# EAGLE design theremin_gross (EAGLE 5.10)
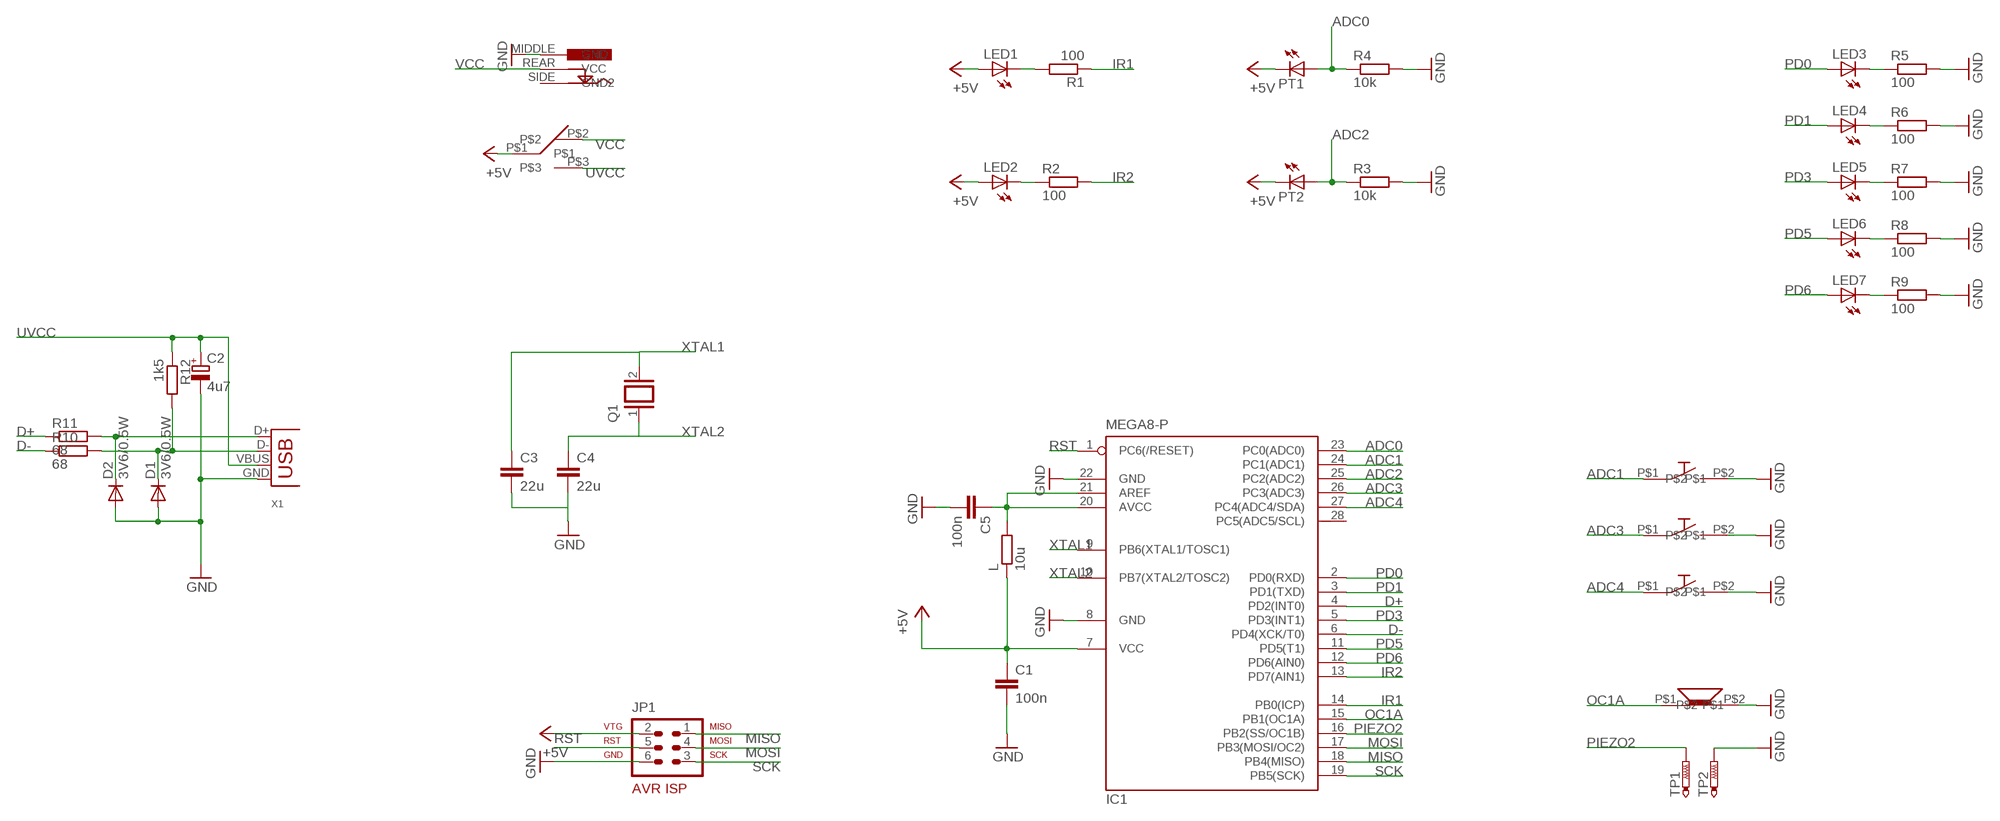
[diagram p0: schematic, sheet 1]

## Parts
C1  100n  C-EU025-025X050  [C025-025X050]
C2  4u7  CPOL-EUE1.8-4  [E1,8-4]
C3  22u  C-EU025-025X050  [C025-025X050]
C4  22u  C-EU025-025X050  [C025-025X050]
C5  100n  C-EU025-025X050  [C025-025X050]
D1  3V6/0.5W  DIODE-D-5  [D-5]
D2  3V6/0.5W  DIODE-D-5  [D-5]
IC1  MEGA8-P  [DIL28-3]
JP1  AVR-ISP-6  [AVR-ISP-6]
L  10u  R-EU_0207/10  [0207/10]
LED1  LED3MM  [LED3MM]
LED2  LED3MM  [LED3MM]
LED3  LED5MM  [LED5MM]
LED4  LED5MM  [LED5MM]
LED5  LED5MM  [LED5MM]
LED6  LED5MM  [LED5MM]
LED7  LED5MM  [LED5MM]
PT1  LED3MM  [LED3MM]
PT2  LED3MM  [LED3MM]
Q1  XTAL/S  [QS]
R1  100  R-EU_0207/10  [0207/10]
R2  100  R-EU_0207/10  [0207/10]
R3  10k  R-EU_0207/10  [0207/10]
R4  10k  R-EU_0207/10  [0207/10]
R5  100  R-EU_0207/10  [0207/10]
R6  100  R-EU_0207/10  [0207/10]
R7  100  R-EU_0207/10  [0207/10]
R8  100  R-EU_0207/10  [0207/10]
R9  100  R-EU_0207/10  [0207/10]
R10  68  R-EU_0207/10  [0207/10]
R11  68  R-EU_0207/10  [0207/10]
R12  1k5  R-EU_0207/10  [0207/10]
TP1  PTR1PAD1-20  [P1-20]
TP2  PTR1PAD1-20  [P1-20]
U$1  TASTER1032  [TASTER1032]
U$2  JACK-2.1MM  [JACK-2.1MM]
U$3  SCHALTER-KIP1PUM  [CSD-KIP1PUM]
U$4  PIEZO-A3  [PIEZO-A3]
U$6  TASTER1032  [TASTER1032]
U$7  TASTER1032  [TASTER1032]
X1  USB-MB-H  [USB-MB-H]

## Nets
+5V: C1.1 IC1.7(VCC) JP1.2 L.1 LED1.A LED2.A PT1.K(C) PT2.K(C) U$3.P$1
ADC0: IC1.23(PC0(ADC0)) PT1.A R4.1
ADC1: IC1.24(PC1(ADC1)) U$1.P$1
ADC2: IC1.25(PC2(ADC2)) PT2.A R3.1
ADC3: IC1.26(PC3(ADC3)) U$6.P$1
ADC4: IC1.27(PC4(ADC4/SDA)) U$7.P$1
D+: IC1.4(PD2(INT0)) R11.1
D-: IC1.6(PD4(XCK/T0)) R10.1
GND: C1.2 C2.- C3.2 C4.2 C5.2 D1.A D2.A IC1.8(GND) IC1.22(GND) JP1.6 R3.2 R4.2 R5.2 R6.2 R7.2 R8.2 R9.2 TP2.TP U$1.P$2 U$2.MIDDLE(GND) U$4.P$2 U$6.P$2 U$7.P$2 X1.GND
IR1: IC1.14(PB0(ICP)) R1.1
IR2: IC1.13(PD7(AIN1)) R2.2
MISO: IC1.18(PB4(MISO)) JP1.1
MOSI: IC1.17(PB3(MOSI/OC2)) JP1.4
N$1: LED2.K(C) R2.1
N$2: LED1.K(C) R1.2
N$3: LED3.K(C) R5.1
N$4: D1.C R10.2 R12.2 X1.D-
N$5: LED4.K(C) R6.1
N$6: D2.C R11.2 X1.D+
N$7: LED5.K(C) R7.1
N$8: C5.1 IC1.20(AVCC) IC1.21(AREF) L.2
N$9: LED6.K(C) R8.1
N$11: LED7.K(C) R9.1
OC1A: IC1.15(PB1(OC1A)) U$4.P$1
PD0: IC1.2(PD0(RXD)) LED3.A
PD1: IC1.3(PD1(TXD)) LED4.A
PD3: IC1.5(PD3(INT1)) LED5.A
PD5: IC1.11(PD5(T1)) LED6.A
PD6: IC1.12(PD6(AIN0)) LED7.A
PIEZO2: IC1.16(PB2(SS/OC1B)) TP1.TP
RST: IC1.1(PC6(/RESET)) JP1.5
SCK: IC1.19(PB5(SCK)) JP1.3
UVCC: C2.+ R12.1 U$3.P$3 X1.VBUS
VCC: U$2.REAR(VCC) U$3.P$2
XTAL1: C3.1 IC1.9(PB6(XTAL1/TOSC1)) Q1.2
XTAL2: C4.1 IC1.10(PB7(XTAL2/TOSC2)) Q1.1
Unconnected: IC1.28(PC5(ADC5/SCL)) U$2.SIDE(GND2)

## Library data of the parts
C1 C3-C5 = resistor:C-EU: CAPACITOR, European symbol
C2 = rcl:CPOL-EU: POLARIZED CAPACITOR, European symbol
D1 D2 = diode:DIODE-: DIODE
IC1 = atmel:MEGA8-P: MICROCONTROLLER 8 Kbytes FLASH, 1 kbytes SRAM, 512 bytes EEPROM, USART, 4-channel 10 bit ADC, 2-channel 8 bit ADC Pin compatible with Atmega48, ATMega88, ATMega168 Source: avr.lbr
JP1 = avr-6:AVR-ISP-6: AVR ISP-6 Serial Programming Header
L = rcl:R-EU_: RESISTOR, European symbol
LED1-LED7 PT1 PT2 = led:LED: LED OSRAM: - CHIPLED LG R971, LG N971, LY N971, LG Q971, LY Q971, LO R971, LY R971 LH N974, LH R974 LS Q976, LO Q976, LY Q976 LO Q996 - Hyper CHIPLED LW Q18S LB Q993, LB Q99A, LB R99A - SideLED LS A670, LO A670, LY A670, LG A670, LP A670 LB A673, LV A673, LT A673, LW A673 LH A674 LY A675 LS A676, LA A676, LO A676, LY A676, LW A676 LS A679, LY A679, LG A679 - Hyper Micro SIDELED® LS Y876, LA Y876, LO Y876, LY Y876 LT Y87S - SmartLED LW L88C, LW L88S LB L89C, LB L89S, LG L890 LS L89K, LO L89K, LY L89K LS L896, LA L896, LO L896, LY L896 - TOPLED LS T670, LO T670, LY T670, LG T670, LP T670 LSG T670, LSP T670, LSY T670, LOP T670, LYG T670 LG T671, LOG T671, LSG T671 LB T673, LV T673, LT T673, LW T673 LH T674 LS T676, LA T676, LO T676, LY T676, LB T676, LH T676, LSB T676, LW T676 LB T67C, LV T67C, LT T67C, LS T67K, LO T67K, LY T67K, LW E67C LS E67B, LA E67B, LO E67B, LY E67B, LB E67C, LV E67C, LT E67C LW T67C LS T679, LY T679, LG T679 LS T770, LO T770, LY T770, LG T770, LP T770 LB T773, LV T773, LT T773, LW T773 LH T774 LS E675, LA E675, LY E675, LS T675 LS T776, LA T776, LO T776, LY T776, LB T776 LHGB T686 LT T68C, LB T68C - Hyper Mini TOPLED® LB M676 - Mini TOPLED Santana® LG M470 LS M47K, LO M47K, LY M47K Source: http://www.osram.convergy.de LUXEON: - LUMILED® LXK2-PW12-R00, LXK2-PW12-S00, LXK2-PW14-U00, LXK2-PW14-V00 LXK2-PM12-R00, LXK2-PM12-S00, LXK2-PM14-U00 LXK2-PE12-Q00, LXK2-PE12-R00, LXK2-PE12-S00, LXK2-PE14-T00, LXK2-PE14-U00 LXK2-PB12-K00, LXK2-PB12-L00, LXK2-PB12-M00, LXK2-PB14-N00, LXK2-PB14-P00, LXK2-PB14-Q00 LXK2-PR12-L00, LXK2-PR12-M00, LXK2-PR14-Q00, LXK2-PR14-R00 LXK2-PD12-Q00, LXK2-PD12-R00, LXK2-PD12-S00 LXK2-PH12-R00, LXK2-PH12-S00 LXK2-PL12-P00, LXK2-PL12-Q00, LXK2-PL12-R00 Source: www.luxeon.com KINGBRIGHT: KA-3528ASYC Source: www.kingbright.com
Q1 = special:XTAL/S: CRYSTAL
R1-R12 = resistor:R-EU_: RESISTOR, European symbol
TP1 TP2 = testpad:PTR1: TEST PIN
U$1 U$6 U$7 = theremin:TASTER1032
U$2 = theremin:JACK-2.1MM
U$3 = theremin:SCHALTER-KIP1PUM
U$4 = theremin:PIEZO-A3: pui audio Transducer (Piezo) AT-5210-TT-R
X1 = con-usb-3:USB: USB Connectors

## Board
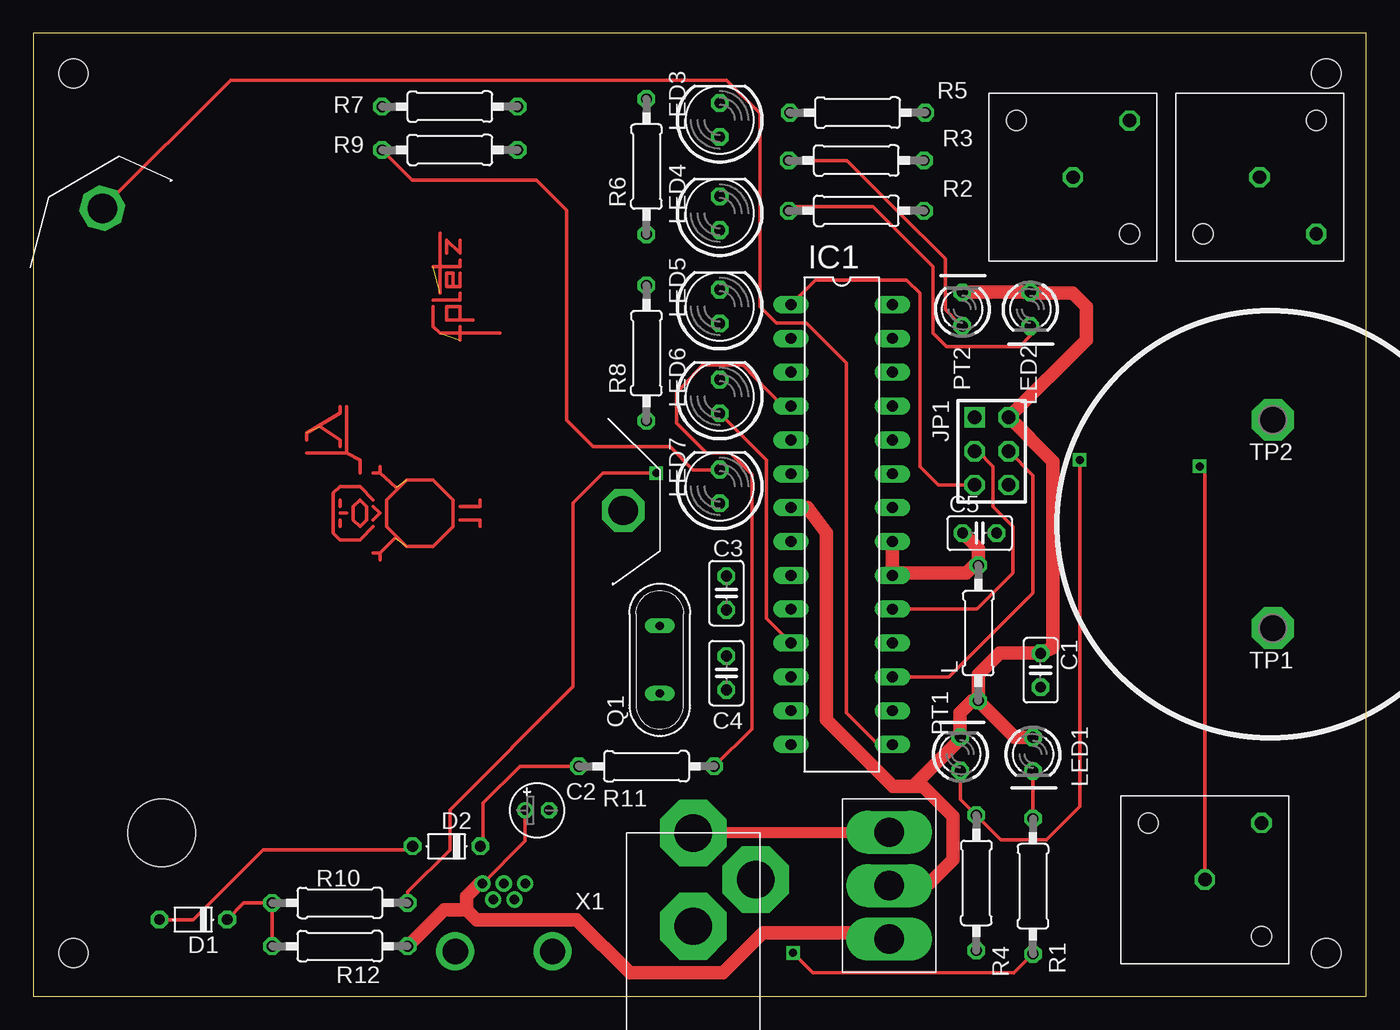
[diagram p1: board, top side]
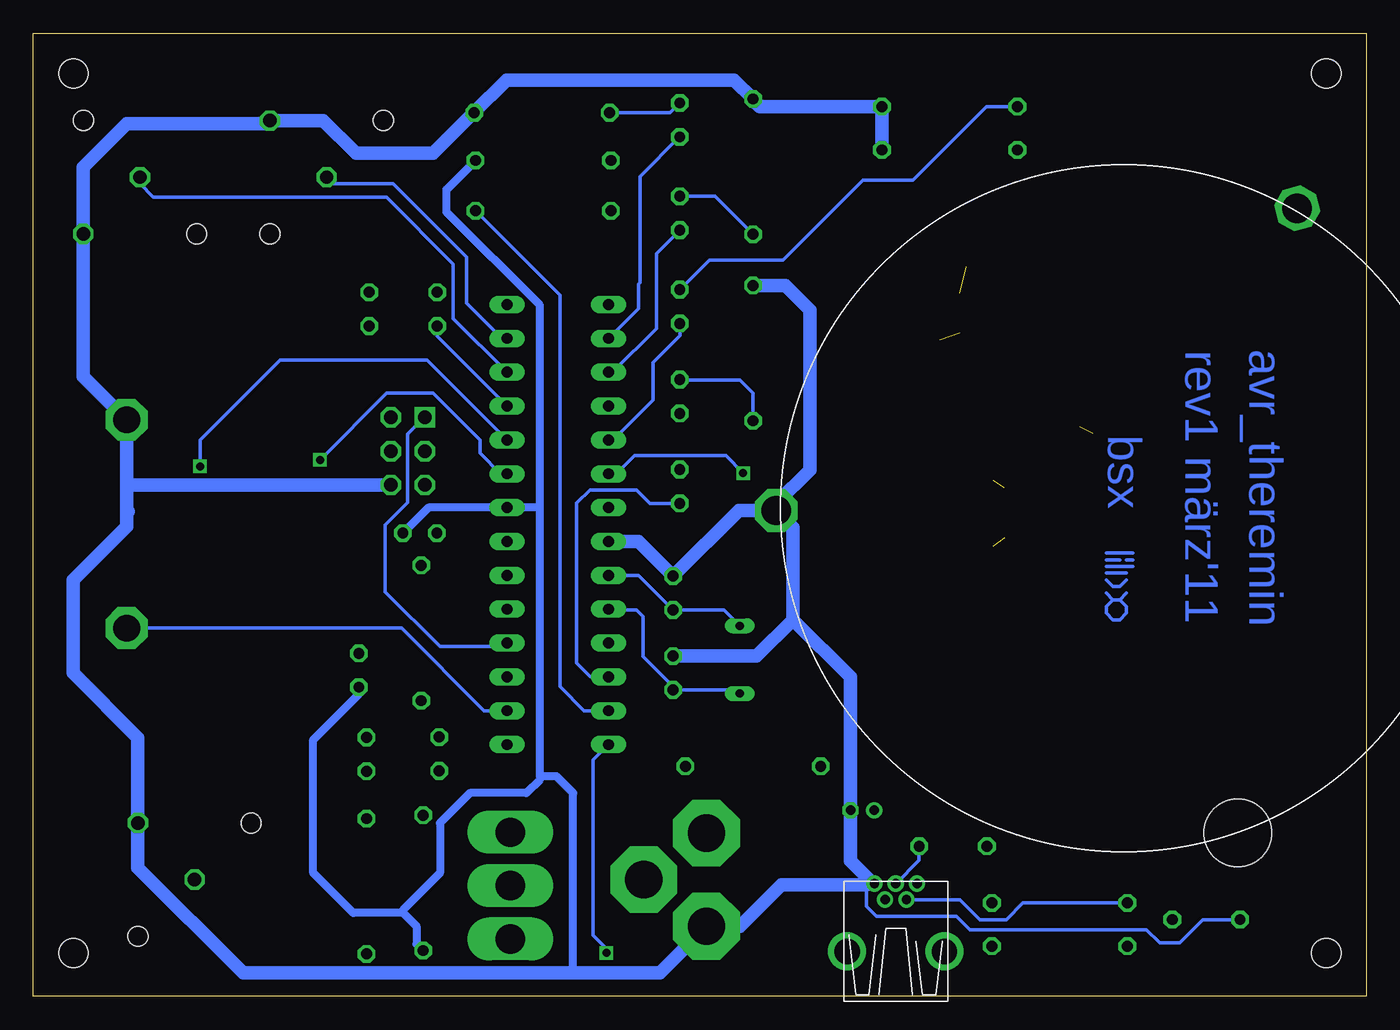
[diagram p2: board, bottom side, seen from below]

Size 100 x 72.25 mm. Coordinates in mm from the lower left corner, seen from the top.
Outline: 0,0 100,0 100,72.25 0,72.25 0,0
Copper layers (1*16): Top 0.035mm / dielectric 1.5mm / Bottom 0.035mm
Design rules "default *": minimum track width 8mil, minimum drill 8mil, track to track 8mil, track to pad 8mil, pad to pad 8mil, via to via 8mil, smd to smd 8mil, copper to edge 40mil, drill to drill 8mil, minimum pad ring 10mil, minimum via ring 8mil, stop-mask expansion 4mil, vias tented up to drill 0mil, thermal gap 10mil
Holes 2.2 mm at 97,69.25 97,3.25 3,3.25 3,69.25

### Footprints (pad centres in the part's own frame; a part is rotated, then mirrored left to right if it is on the bottom)
C025-025X050 = drill 0.813 octagon: 1 -1.27,0; 2 1.27,0
E1,8-4 = drill 0.711 pad 1.168 round: + -0.889,0 | drill 0.711 pad 1.168 octagon: - 0.889,0
D-5 = drill 0.813 octagon: A 2.54,0; C -2.54,0
DIL28-3 = drill 0.813 long: 1 -16.51,-3.81; 2 -13.97,-3.81; 3 -11.43,-3.81; 4 -8.89,-3.81; 5 -6.35,-3.81; 6 -3.81,-3.81; 7 -1.27,-3.81; 8 1.27,-3.81; 9 3.81,-3.81; 10 6.35,-3.81; 11 8.89,-3.81; 12 11.43,-3.81; 13 13.97,-3.81; 14 16.51,-3.81; 15 16.51,3.81; 16 13.97,3.81; 17 11.43,3.81; 18 8.89,3.81; 19 6.35,3.81; 20 3.81,3.81; 21 1.27,3.81; 22 -1.27,3.81; 23 -3.81,3.81; 24 -6.35,3.81; 25 -8.89,3.81; 26 -11.43,3.81; 27 -13.97,3.81; 28 -16.51,3.81
AVR-ISP-6 = drill 1.016 square: 1 -2.54,-1.27 | drill 1.016 octagon: 2 -2.54,1.27; 3 0,-1.27; 4 0,1.27; 5 2.54,-1.27; 6 2.54,1.27
0207/10 = drill 0.813 octagon: 1 -5.08,0; 2 5.08,0
LED3MM = drill 0.813 octagon: A -1.27,0; K 1.27,0
LED5MM = drill 0.813 octagon: A -1.27,0; K 1.27,0
QS = drill 0.61 long: 1 -2.54,0; 2 2.54,0
P1-20 = drill 2.007 pad 3.15 octagon: TP 0,0
TASTER1032 = drill 1 octagon: P$1 0,0; P$2 4.25,4.25 | hole 1.5: -4.25,4.25; 4.25,-4.25
JACK-2.1MM = drill 2.8 pad 5 octagon: MIDDLE 8,-5; REAR 15,-5; SIDE 11.5,-9.7
CSD-KIP1PUM = drill 2.2 long: P$1 3.5,-6.5; P$2 3.5,-2.5; P$3 3.5,-10.5
PIEZO-A3 = drill 2.2 octagon: P$1 -12.822,22.868; P$2 26.261,0.196 | hole 5.08: -8.382,-24.003
USB-MB-H = drill 0.7 round: D+ 5.1,0; D- 3.9,0.8; GND 5.1,-1.6; ID 3.9,-0.8; VBUS 5.1,1.6 | drill 1.9 round: P$6 0,-3.65; P$7 0,3.65

### Placement (x,y rotation side)
C1  75.57,24.46 270 top
C2  37.8,13.95 0 top
C3  52,30.25 90 top
C4  52,24.25 90 top
C5  71,34.75 0 top
D1  12,5.75 180 top
D2  31,11.25 180 top
IC1  60.65,35.39 270 top
JP1  71.91,40.9 270 top
L  70.9,27.25 90 top
LED1  75,18.15 270 top
LED2  74.8,51.55 270 top
LED3  51.5,65.75 90 top
LED4  51.5,58.75 90 top
LED5  51.5,51.75 90 top
LED6  51.5,45 90 top
LED7  51.5,38.25 90 top
PT1  69.55,18.18 90 top
PT2  69.7,51.55 90 top
Q1  47,25.25 90 top
R1  75,8.25 90 top
R2  61.75,58.93 0 top
R3  61.75,62.71 0 top
R4  70.75,8.5 270 top
R5  61.84,66.3 0 top
R6  46,62.25 90 top
R7  31.25,66.75 0 top
R8  46,48.25 90 top
R9  31.25,63.5 0 top
R10  23,7 180 top
R11  46,17.25 180 top
R12  23,3.75 180 top
TP1  93,27.61 180 top
TP2  93,43.25 180 top
U$1  87.9,8.75 0 top
U$2  44.5,-2.75 90 top
U$3  60.7,14.8 0 top
U$4  18,36.25 0 top
U$6  92,61.45 270 top
U$7  78,61.45 0 top
X1  35.3,3.35 90 top

### Tracks (layer width: path | path; a pad name or v marks a point on that pad's centre or on a via)
+5V
  Top 1.016: PT2.K LED2.A 74.87,52.75 78,52.75 79,51.75 79,49.25 78.99,49.25 JP1.2 76.5,40.11 76.5,26.15 C1.1 75.55,25.75 72.5,25.75 70.9,24.15 L.1 | LED1.A 73.65,19.42 L.1 | L.1 70.42,22.17 69.5,21.25 69.5,19.5 PT1.K 69.55,19.3 66,15.75 | IC1.7 58.09,36.66 59.5,34.75 59.5,20.75 64.5,15.75 66,15.75 | 66,15.75 66.75,15.75 69,13.5 69,10.25 67.25,8.5 64.4,8.5 U$3.P$1
ADC0  (via drill 0.6)
  Top 0.254: v78.5,40.25 78.5,14.25 76,11.75 72.58,11.75 R4.1 69.55,14.78 PT1.A
  Bottom 0.254: IC1.23 64.95,39.2 66.5,40.75 66.5,41.75 70,45.25 73.5,45.25 v78.5,40.25
ADC1  (via drill 0.6)
  Top 0.254: v87.5,39.75 87.9,39.35 U$1.P$1
  Bottom 0.254: IC1.24 70.47,47.75 81.5,47.75 87.5,41.75 v87.5,39.75
ADC2
  Top 0.254: R3.1 61.06,62.71 64.87,58.88 64.88,58.86 68.42,55.33 68.42,51.5 69.64,50.28 PT2.A
  Bottom 0.254: IC1.25 69.7,49.52 PT2.A
ADC3
  Bottom 0.254: IC1.26 68.5,50.86 68.5,54.95 73.5,59.95 91,59.95 92,60.95 U$6.P$1
ADC4
  Bottom 0.254: IC1.27 64.82,49.5 65,49.5 67.5,52 67.5,55.45 73,60.95 77.5,60.95 U$7.P$1
D+
  Top 0.254: IC1.4 56.22,44.28 53.25,47.35 50.2,47.35 48.25,45.25 48.25,43 50.5,40.75 52.3,40.75 53.9,39.15 53.9,20.07 R11.1
D-  (via drill 0.6)
  Top 0.254: R10.1 28.08,7.83 31.25,11 31.25,14 40.5,23.25 40.5,37 42.75,39.25 v46.75,39.25
  Bottom 0.254: v46.75,39.25 48.05,40.55 54.9,40.55 56.3,39.2 IC1.6
GND
  Top 0.254: D1.A 12,5.75 17.25,11 28.21,11 D2.A
  Bottom 0.254: D1.A 12.25,5.75 14,4 15.5,4 16.5,5 29.75,5 30.75,6 36.75,6 37.5,6.75 37.5,8.38
  Bottom 0.61: 62,16.5 62,16.25 63,15.25 67.25,15.25 69.5,13 69.5,9.25 72.25,6.5 72.25,6.25 | 62,16.5 62,36.66 | 62,36.66 IC1.22 70.36,36.66 C5.2 | C1.2 75.57,22.68 79,19.25 79,9.25 76,6.25 72.25,6.25 | R4.2 71.25,3.92 71.25,5.25 72.25,6.25 | 62,16.5 60.75,16.5 59.5,15.25 59.5,1.75 | 62,36.66 62,51.85 69,58.85 69,60.54 R3.2
  Bottom 1.016: 66.97,66.25 67,66.25 70,63.25 75.8,63.25 78.25,65.7 U$7.P$2 82.5,65.45 93,65.45 96.25,62.2 U$6.P$2 96.25,46.5 TP2.TP 93,38.25 | 66.97,66.25 R5.2 | 93,36.25 93,35.25 97,31.25 97,24.25 92.15,19.4 U$1.P$2 92.15,9.65 84.25,1.75 59.5,1.75 53,1.75 U$2.MIDDLE 47,5.25 43.88,8.38 37.5,8.38 37.42,8.45 36.98,8.45 | 93,36.25 93,38.25 | 93,36.25 92.89,36.36 | 66.97,66.25 66.97,66.28 64.5,68.75 47.42,68.75 R6.2 46,67.25 45.5,66.75 R7.2 R9.2 | IC1.8 54.6,34.12 C3.2 47.07,36.45 U$4.P$2 | U$4.P$2 44.26,36.99 41.75,39.5 41.75,51.5 43.58,53.33 R8.2 | C4.2 45.73,25.52 43,28.25 | 43,28.25 43,35.19 U$4.P$2 | 43,28.25 38.69,23.94 C2.- 38.69,10.16 36.98,8.45 | JP1.6 92.89,38.36 93,38.25 | 36.98,8.45 X1.GND
IR1  (via drill 0.6)
  Top 0.254: R1.1 73.58,1.75 58.5,1.75 v57,3.25
  Bottom 0.254: v57,3.25 56.84,3.41 58,4.57 58,17.72 IC1.14
IR2
  Bottom 0.254: R2.2 60.5,52.61 60.5,23.25 58.67,21.42 IC1.13
MISO
  Bottom 0.254: IC1.18 64.5,26.46 64.5,26.25 69.5,26.25 73.6,30.35 73.6,35.35 71.9,37.05 71.9,42.17 JP1.1
MOSI
  Top 0.254: IC1.17 68.71,23.96 75,30.25 75,39.07 JP1.4
N$1
  Top 0.254: R2.1 56.98,59.25 63,59.25 67.5,54.75 67.5,49.75 68.5,48.75 74,48.75 74.8,49.55 LED2.K
N$2
  Top 0.254: R1.2 LED1.K
N$3
  Bottom 0.254: R5.1 52.22,66.3 LED3.K
N$4
  Top 0.254: R12.2 R10.2 15.79,7 D1.C
  Bottom 0.254: R10.2 25.75,7 27,5.75 29,5.75 30.5,7.25 X1.D-
N$5
  Bottom 0.254: R6.1 48.85,60.02 LED4.K
N$6
  Top 0.254: D2.C 33.75,11.46 33.75,14.5 36.5,17.25 R11.2
  Bottom 0.254: D2.C 33.54,10.21 X1.D+
N$7
  Bottom 0.254: R7.1 28.5,66.75 34,61.25 37.75,61.25 43.75,55.25 49.27,55.25 LED5.K
N$8
  Top 1.016: IC1.21 IC1.20 64.63,31.75 70,31.75 70.58,32.33 L.2 70.9,33.58 C5.1
N$9
  Bottom 0.254: R8.1 46,45.25 47,46.25 51.48,46.25 LED6.K
N$10
  Bottom 0.254: 17.5,33.25 19.5,33.25
N$11
  Top 0.254: R9.1 28.42,61.25 37.75,61.25 40,59 40,43.25 42,41.25 47.75,41.25 49.5,39.5 51.48,39.5 LED7.K
N$12
  Bottom 0.254: 18.5,32.75 19.5,32.75
N$13
  Bottom 0.254: 17.5,32.75 18,32.75
N$14
  Bottom 0.254: 17.5,32.25 19.5,32.25
N$15
  Bottom 0.254: 18,31.75 19.5,31.75
N$16
  Bottom 0.254: 18,31.25 18.5,30.75 19,30.75 19.5,31.25
N$17
  Bottom 0.254: 18.5,29.75 18,30.25 | 19,29.75 18.5,29.75 | 19,29.75 19.5,30.25 | 18.5,29.75 18,29.25 18,28.75 18.5,28.25 19,28.25 19.5,28.75 19.5,29.25 19,29.75
N$18  (1 unrouted)
  Top 0.254: 30,51.75 30,50.25 30.5,49.75 35,49.75 | 32,49.25 32,50.25
N$20
  Top 0.254: 32,50.75 31,50.75 31,51.75 32,51.75 32,50.75 | 32,50.75 33,50.75
N$21
  Top 0.254: 30,52.25 32,52.25 32,52.75
N$22
  Top 0.254: 31.5,53.25 31,53.25 31,54.25 31.5,54.25 31.5,53.25 | 31.5,53.25 32,53.25 32,54.25
N$23  (1 unrouted)
  Top 0.254: 30,54.75 32,54.75 32,55.25 | 30.5,52.75 30.5,57.25
N$25
  Top 0.254: 31,55.75 31,56.75 32,55.75 32,56.75
N$26  (2 unrouted)
  Top 0.254: 26,33.25 27.15,34.4 | 26,32.75 26,33.25 | 26,33.25 25.5,33.25 | 26,39.25 27.2,38.15 | 26,39.25 25.5,39.25 | 26,39.75 26,39.25 | 26.5,35.25 26.5,37.25 28,38.75 30,38.75 31.5,37.25 31.5,35.25 30,33.75 28,33.75 26.5,35.25
N$27
  Top 0.254: 25.5,35.75 26,36.25 25.5,36.75
N$28
  Top 0.254: 24,35.75 24,36.75 24.5,37.25 25,36.75 25,35.75 24.5,35.25 24,35.75
N$29
  Top 0.254: 23.5,36.25 23,36.25
N$30
  Top 0.254: 23,35.25 23,35.75
N$31
  Top 0.254: 23,37.25 23,36.75
N$32
  Top 0.254: 24.5,39.25 24.5,40.25 23.5,40.75 | 20.5,40.75 23.5,40.75 | 23.5,40.75 23.5,44.25
N$33
  Top 0.254: 25.5,35.25 24.5,34.25 23,34.25 22.5,34.75 22.5,37.75 23,38.25 24.5,38.25 25.5,37.25
N$36
  Top 0.254: 32,36.75 33.5,36.75 33.5,37.25
N$37
  Top 0.254: 32,35.75 33.5,35.75 33.5,35.25
N$38  (1 unrouted)
  Top 0.254: 20.5,41.75 20.5,42.25 23,43.75 23,44.25 | 21.5,42.75 23,41.75 23,41.25
OC1A
  Top 0.254: IC1.15 63.37,18.88 61,21.25 61,47.5 58,50.5 55.75,50.5 54.5,51.75 54.5,66.25 52,68.75 14.81,68.75 U$4.P$1
PD0
  Bottom 0.254: LED3.A 51.52,64.48 54.5,61.5 54.5,53.55 54.6,53.45 54.6,51.6 IC1.2
PD1
  Bottom 0.254: LED4.A 53.25,55.73 53.25,50.1 56.53,46.82 IC1.3
PD3
  Bottom 0.254: IC1.5 56.51,41.74 53.5,44.75 53.5,47.55 51.5,49.55 LED5.A
PD5
  Top 0.254: IC1.11 55,28.34 55,40.23 LED6.A
PD6
  Bottom 0.254: IC1.12 56.88,24 58.25,24 59.25,25 59.25,37 58.25,38 54.75,38 53.73,36.98 LED7.A
PIEZO2
  Bottom 0.254: IC1.16 66.17,21.42 72.36,27.61 TP1.TP
RST
  Top 0.254: JP1.5 67.89,38.36 66.5,39.75 66.5,52.75 65.5,53.75 58.69,53.75 IC1.1
SCK
  Top 0.254: IC1.19 70.79,29.04 73.5,31.75 73.5,35.25 72,36.75 72,39.75 70.85,40.9 JP1.3
UVCC
  Top 0.254: C2.+ 36.91,11.66 X1.VBUS
  Top 1.016: 32.5,6.5 32.5,7.5 33.45,8.45 X1.VBUS | 32.5,6.5 33.25,5.75 40.75,5.75 44.75,1.75 51.75,1.75 54.75,4.75 63.5,4.75 63.95,4.3 U$3.P$3 | 32.5,6.5 30.83,6.5 R12.1
VCC
  Top 0.813: U$2.REAR 49.55,12.3 U$3.P$2
XTAL1
  Bottom 0.254: IC1.9 54.6,31.58 C3.1 48.19,28.98 Q1.2
XTAL2
  Bottom 0.254: IC1.10 56.8,29 54.75,29 54.25,28.5 54.25,25.5 52,23.25 C4.1 47.27,22.98 Q1.1

### Text on the board
Bottom: avr_theremin | rev1 märz'11 | bsx